# Altium schematic sheet PowerSheet.SchDoc
size 208 x 152 mm
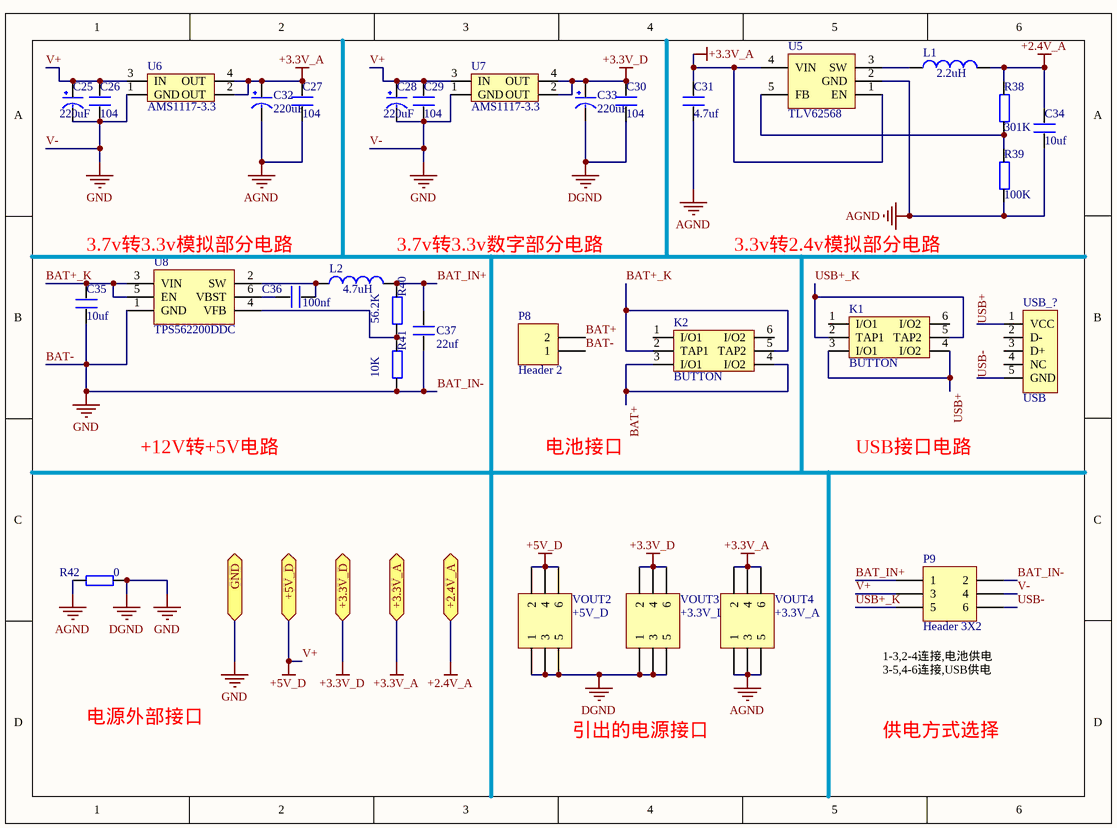
[diagram p0: PowerSheet.SchDoc]

## Parts
C25  220uF  [CC6.56.5]
C26  104  [0805]
C27  104  [0805]
C28  220uF  [CC6.56.5]
C29  104  [0805]
C30  104  [0805]
C31  4.7uf  [0805]
C32  220uF  [CC6.56.5]
C33  220uF  [CC6.56.5]
C34  10uf  [0805]
C35  10uf  [0805]
C36  100nf  [0805]
C37  22uf  [0805]
K1  BUTTON  [BTN8.5*8.5]
K2  BUTTON  [BTN8.5*8.5]
L1  value 2.2uH  [SDR0403]  (hidden comment: Inductor)
L2  value 4.7uH  [SDR0805]  (hidden comment: Inductor)
P8  Header 2  [HDR1X2]
P9  Header 3X2  [HDR2X3]
R38  301K  [0805]
R39  100K  [0805]
R40  56.2K  [0805]
R41  10K  [0805]
R42  0  [0805]
U5  TLV62568  [LC-SOT-23-5]
U6  AMS1117-3.3  [AMS1117]
U7  AMS1117-3.3  [AMS1117]
U8  TPS562200DDC  [LC-SOT-23-6]
USB_?  USB  [USB/SM0.8-6H5]
VOUT2  +5V_D  [HDR2X3]
VOUT3  +3.3V_D  [HDR2X3]
VOUT4  +3.3V_A  [HDR2X3]

## Ports
+2.4V_A, +3.3V_A, +3.3V_D, +5V_D, GND

## Nets
+2.4V_A: C34.2 L1.2 R38.2 ; port +2.4V_A
+3.3V_A: C27.2 C31.2 C32.1(VCC) U5.1(EN) U5.4(VIN) U6.2(OUT) U6.4(OUT) VOUT4.2 VOUT4.4 VOUT4.6 ; port +3.3V_A
+3.3V_D: C30.2 C33.1(VCC) U7.2(OUT) U7.4(OUT) VOUT3.2 VOUT3.4 VOUT3.6 ; port +3.3V_D
AGND: C27.1 C31.1 C32.2(GND) C34.1 R39.1 R42.1 U5.2(GND) VOUT4.1 VOUT4.3 VOUT4.5
BAT-: C25.2(GND) C26.1 C28.2(GND) C29.1 C30.1 C33.2(GND) C35.1 C37.2 P8.1 P9.2 P9.4 R41.1 R42.2 U6.1(GND) U7.1(GND) U8.1(GND) VOUT2.1 VOUT2.3 VOUT2.5 VOUT3.1 VOUT3.3 VOUT3.5 ; port GND  [also labelled BAT_IN-, DGND, GND, V-]
V+: C25.1(VCC) C26.2 C28.1(VCC) C29.2 P9.3 U6.3(IN) U7.3(IN) VOUT2.2 VOUT2.4 VOUT2.6 ; port +5V_D  [also labelled +5V_D]
BAT+: K2.3(I/O1) K2.4(I/O2) P8.2
BAT+_K: C35.2 K2.2(TAP1) K2.5(TAP2) U8.3(VIN) U8.5(EN)
BAT_IN+: C37.1 L2.2 P9.1 R40.2
USB+: K1.3(I/O1) K1.4(I/O2) USB_?.1(VCC)
USB+_K: K1.2(TAP1) K1.5(TAP2) P9.5
USB-: P9.6 USB_?.5(GND)
NetC36_1: C36.1 L2.1 U8.2(SW)
NetC36_2: C36.2 U8.6(VBST)
NetL1_1: L1.1 U5.3(SW)
NetR38_1: R38.1 R39.2 U5.5(FB)
NetR40_1: R40.1 R41.2 U8.4(VFB)

Not connected (* = marked no-connect by the designer): K1 1(I/O1) 6(I/O2); K2 1(I/O1) 6(I/O2); USB_? 2(D-) 3(D+) 4(NC)

## Notes on the sheet
- 3.7v转3.3v模拟部分电路
- 3.7v转3.3v数字部分电路
- 3.3v转2.4v模拟部分电路
- +12V转+5V电路
- 电池接口
- USB接口电路
- (near P9) 1-3,2-4连接,电池供电
  3-5,4-6连接,USB供电
- 电源外部接口
- 引出的电源接口
- 供电方式选择

## Library data of the parts
C25 C28 C32 C33 = CAP
C26 C27 C29 C30 C35-C37 = C
C31 = C: Cap= 4.7 uF  ESR= 2.0 mOhm  VDC= 25.0 V  IRMS= 7.29 A
C34 = C: Cap= 10.0 uF  ESR= 2.0 mOhm  VDC= 6.3 V  IRMS= 0.0 A
L1 L2 = Inductor: L= 2.2 µH  DCR= 47.0 mOhm; Code_IEC: 1005; Published: 8-Jun-2000; LatestRevisionDate: 29-May-2009; LatestRevisionNote: IPC-7351 Footprint Added.; PackageReference: 0402-A; Publisher: Altium Limited; PackageDescription: Chip Inductor; Code_JEITA: 0402
P8 = Header 2: Header, 2-Pin; LatestRevisionDate: 17-Jul-2002; LatestRevisionNote: Re-released for DXP Platform.; Publisher: Altium Limited
P9 VOUT2-VOUT4 = Header 3X2: Header, 3-Pin, Dual row; LatestRevisionDate: 17-Jul-2002; LatestRevisionNote: Re-released for DXP Platform.; Publisher: Altium Limited
R38 R40 R41 = R: Res= 100.0 kOhm  Power= 125.0 mW  Tolerance= 1.0%
R39 = R: Res= 301.0 kOhm  Power= 125.0 mW  Tolerance= 1.0%
R42 = R
U6 U7 = AMS1117
USB_? = USB5